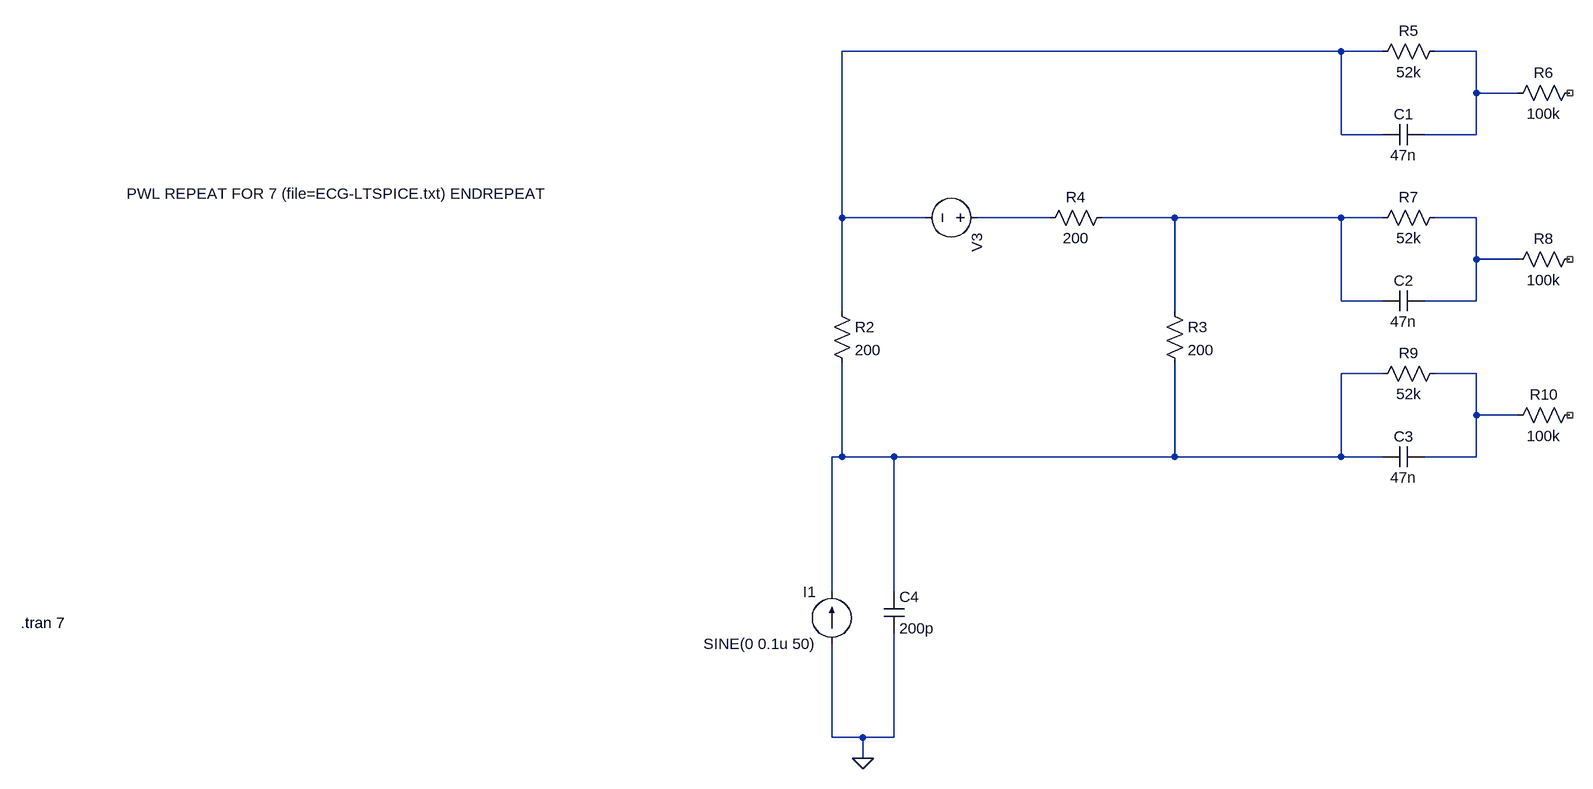
[diagram p0: schematic ecgWAVE.asc]
ecgWAVE.asc, the LTspice schematic file:
Version 4
SHEET 1 2328 804
WIRE 1952 -304 1184 -304
WIRE 2016 -304 1952 -304
WIRE 2160 -304 2096 -304
WIRE 2160 -240 2160 -304
WIRE 2224 -240 2160 -240
WIRE 1952 -176 1952 -304
WIRE 2016 -176 1952 -176
WIRE 2160 -176 2160 -240
WIRE 2160 -176 2080 -176
WIRE 1184 -48 1184 -304
WIRE 1312 -48 1184 -48
WIRE 1504 -48 1392 -48
WIRE 1696 -48 1584 -48
WIRE 1952 -48 1696 -48
WIRE 2016 -48 1952 -48
WIRE 2160 -48 2096 -48
WIRE 2160 16 2160 -48
WIRE 2224 16 2160 16
WIRE 1952 80 1952 -48
WIRE 2016 80 1952 80
WIRE 2160 80 2160 16
WIRE 2160 80 2080 80
WIRE 1184 96 1184 -48
WIRE 1696 96 1696 -48
WIRE 2016 192 1952 192
WIRE 2160 192 2096 192
WIRE 2160 256 2160 192
WIRE 2224 256 2160 256
WIRE 1184 320 1184 176
WIRE 1184 320 1168 320
WIRE 1264 320 1184 320
WIRE 1696 320 1696 176
WIRE 1696 320 1264 320
WIRE 1952 320 1952 192
WIRE 1952 320 1696 320
WIRE 2016 320 1952 320
WIRE 2160 320 2160 256
WIRE 2160 320 2080 320
WIRE 1168 528 1168 320
WIRE 1264 528 1264 320
WIRE 1168 752 1168 608
WIRE 1216 752 1168 752
WIRE 1264 752 1264 592
WIRE 1264 752 1216 752
WIRE 1216 784 1216 752
FLAG 1216 784 0
SYMBOL res 1168 80 R0
SYMATTR InstName R2
SYMATTR Value 200
SYMBOL res 1680 80 R0
SYMATTR InstName R3
SYMATTR Value 200
SYMBOL voltage 1408 -48 R90
WINDOW 3 -37 681 VRight 2
SYMATTR Value PWL REPEAT FOR 7 (file=ECG-LTSPICE.txt) ENDREPEAT
SYMATTR InstName V3
SYMBOL res 1600 -64 R90
WINDOW 0 0 56 VBottom 2
WINDOW 3 32 56 VTop 2
SYMATTR InstName R4
SYMATTR Value 200
SYMBOL res 2112 -320 R90
WINDOW 0 0 56 VBottom 2
WINDOW 3 32 56 VTop 2
SYMATTR InstName R5
SYMATTR Value 52k
SYMBOL cap 2080 -192 R90
WINDOW 0 0 32 VBottom 2
WINDOW 3 32 32 VTop 2
SYMATTR InstName C1
SYMATTR Value 47n
SYMBOL res 2320 -256 R90
WINDOW 0 0 56 VBottom 2
WINDOW 3 32 56 VTop 2
SYMATTR InstName R6
SYMATTR Value 100k
SYMBOL res 2112 -64 R90
WINDOW 0 0 56 VBottom 2
WINDOW 3 32 56 VTop 2
SYMATTR InstName R7
SYMATTR Value 52k
SYMBOL cap 2080 64 R90
WINDOW 0 0 32 VBottom 2
WINDOW 3 32 32 VTop 2
SYMATTR InstName C2
SYMATTR Value 47n
SYMBOL res 2320 0 R90
WINDOW 0 0 56 VBottom 2
WINDOW 3 32 56 VTop 2
SYMATTR InstName R8
SYMATTR Value 100k
SYMBOL res 2112 176 R90
WINDOW 0 0 56 VBottom 2
WINDOW 3 32 56 VTop 2
SYMATTR InstName R9
SYMATTR Value 52k
SYMBOL cap 2080 304 R90
WINDOW 0 0 32 VBottom 2
WINDOW 3 32 32 VTop 2
SYMATTR InstName C3
SYMATTR Value 47n
SYMBOL res 2320 240 R90
WINDOW 0 0 56 VBottom 2
WINDOW 3 32 56 VTop 2
SYMATTR InstName R10
SYMATTR Value 100k
SYMBOL current 1168 608 R180
WINDOW 0 24 80 Left 2
WINDOW 3 24 0 Left 2
WINDOW 123 0 0 Left 0
WINDOW 39 0 0 Left 0
SYMATTR InstName I1
SYMATTR Value SINE(0 0.1u 50)
SYMBOL cap 1248 528 R0
SYMATTR InstName C4
SYMATTR Value 200p
TEXT -80 576 Left 2 !.tran 7

The netlist it stands for:
* ecgWAVE.asc
R2 N001 N006 200
R3 N004 N006 200
V3 N003 N001 PWL REPEAT FOR 7 (file=ECG-LTSPICE.txt) ENDREPEAT
R4 N004 N003 200
R5 N002 N001 52k
C1 N002 N001 47n
R6 NC_01 N002 100k
R7 N005 N004 52k
C2 N005 N004 47n
R8 NC_02 N005 100k
R9 N007 N006 52k
C3 N007 N006 47n
R10 NC_03 N007 100k
I1 0 N006 SINE(0 0.1u 50)
C4 N006 0 200p
.tran 7
.backanno
.end